# Altium schematic sheet 电机驱动模块A4950.SchDoc
size A4
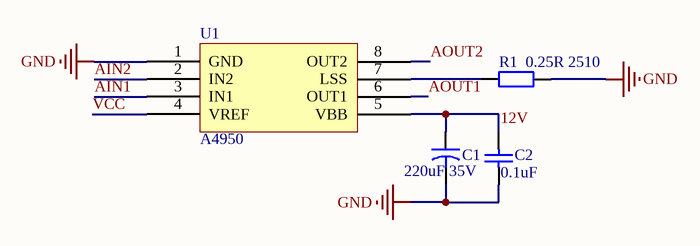
[diagram p0: 电机驱动模块A4950.SchDoc]

## Parts
C1  value 220uF 35V  [CAPR5-4X5]  (hidden comment: Cap2)
C2  value 0.1uF  [RAD-0.3]  (hidden comment: Cap)
R1  value 0.25R 2510  [AXIAL-0.4]  (hidden comment: Res2)
U1  A4950

## Nets
GND: C1.2 C2.1 R1.2 U1.1(GND)
AIN1: U1.3(IN1)
AIN2: U1.2(IN2)
AOUT1: U1.6(OUT1)
AOUT2: U1.8(OUT2)
VCC: U1.4(VREF)
NetC1_1: C1.1 C2.2 U1.5(VBB)
NetR1_1: R1.1 U1.7(LSS)

## Notes on the sheet
- Labels drawn without touching a wire or pin: 12V

## Library data of the parts
C1 = Cap2: Capacitor; Published: 23-Sep-2002; PackageReference: CAPR5-4X5; Publisher: Altium Limited; PackageDescription: Capacitor; 2 Leads
C2 = Cap: Capacitor; Published: 8-Jun-2000; LatestRevisionDate: 17-Jul-2002; LatestRevisionNote: Re-released for DXP Platform.; PackageReference: RAD-0.3; Publisher: Altium Limited; PackageDescription: Radial Cap, Thru-Hole; 2 Leads; 0.3 in Pin Spacing
R1 = Res2: Resistor; Published: 8-Jun-2000; LatestRevisionDate: 17-Jul-2002; LatestRevisionNote: Re-released for DXP Platform.; PackageReference: AXIAL-0.4; Publisher: Altium Limited; PackageDescription: Axial Device, Thru-Hole; 2 Leads; 0.4 in Pin Spacing